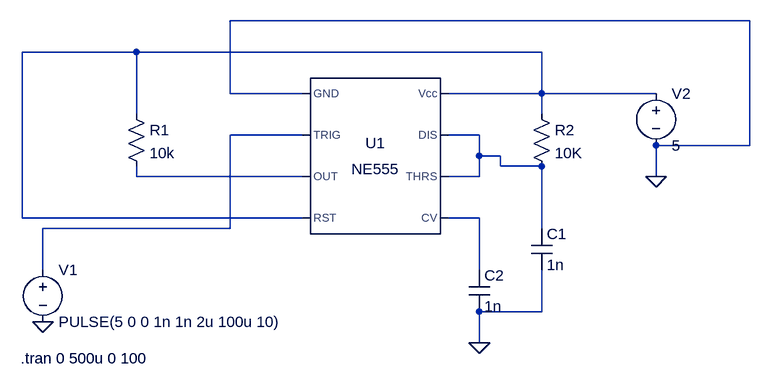
[diagram p0: schematic projet 2caerus.asc]
projet 2caerus.asc, the LTspice schematic file:
Version 4
SHEET 1 1316 680
WIRE 1312 -96 512 -96
WIRE 368 -48 192 -48
WIRE 992 -48 368 -48
WIRE 512 16 512 -96
WIRE 624 16 512 16
WIRE 992 16 992 -48
WIRE 992 16 848 16
WIRE 1168 16 992 16
WIRE 368 48 368 -48
WIRE 992 48 992 16
WIRE 624 80 512 80
WIRE 896 80 848 80
WIRE 1312 96 1312 -96
WIRE 1312 96 1168 96
WIRE 896 112 896 80
WIRE 928 112 896 112
WIRE 928 128 928 112
WIRE 992 128 928 128
WIRE 368 144 368 128
WIRE 624 144 368 144
WIRE 896 144 896 112
WIRE 896 144 848 144
WIRE 1168 144 1168 96
WIRE 192 208 192 -48
WIRE 624 208 192 208
WIRE 896 208 848 208
WIRE 512 224 512 80
WIRE 512 224 224 224
WIRE 992 224 992 128
WIRE 224 288 224 224
WIRE 896 288 896 208
WIRE 992 352 992 288
WIRE 992 352 896 352
WIRE 896 400 896 352
FLAG 896 400 0
FLAG 1168 144 0
FLAG 224 368 0
SYMBOL res 352 32 R0
SYMATTR InstName R1
SYMATTR Value 10k
SYMBOL res 976 32 R0
SYMATTR InstName R2
SYMATTR Value 10K
SYMBOL cap 976 224 R0
SYMATTR InstName C1
SYMATTR Value 1n
SYMBOL cap 880 288 R0
SYMATTR InstName C2
SYMATTR Value 1n
SYMBOL voltage 224 272 R0
WINDOW 123 0 0 Left 0
WINDOW 39 0 0 Left 0
SYMATTR InstName V1
SYMATTR Value PULSE(5 0 0 1n 1n 2u 100u 10)
SYMBOL voltage 1168 0 R0
WINDOW 123 0 0 Left 0
WINDOW 39 0 0 Left 0
SYMATTR InstName V2
SYMATTR Value 5
SYMBOL Misc\\NE555 736 112 R0
SYMATTR InstName U1
TEXT 190 424 Left 2 !.tran 0 500u 0 100

The netlist it stands for:
* projet 2caerus.asc
R1 N001 N004 10k
R2 N001 N003 10K
C1 N003 0 1n
C2 N005 0 1n
V1 N002 0 PULSE(5 0 0 1n 1n 2u 100u 10)
V2 N001 0 5
XU1 0 N002 N004 N001 N005 N003 N003 N001 NE555  ; pins GND TRIG OUT RST CV THRS DIS Vcc
.tran 0 500u 0 100
.lib NE555.sub
.backanno
.end